# Altium schematic sheet Sheet1.SchDoc
size A; SheetNumber: 1; SheetTotal: 1
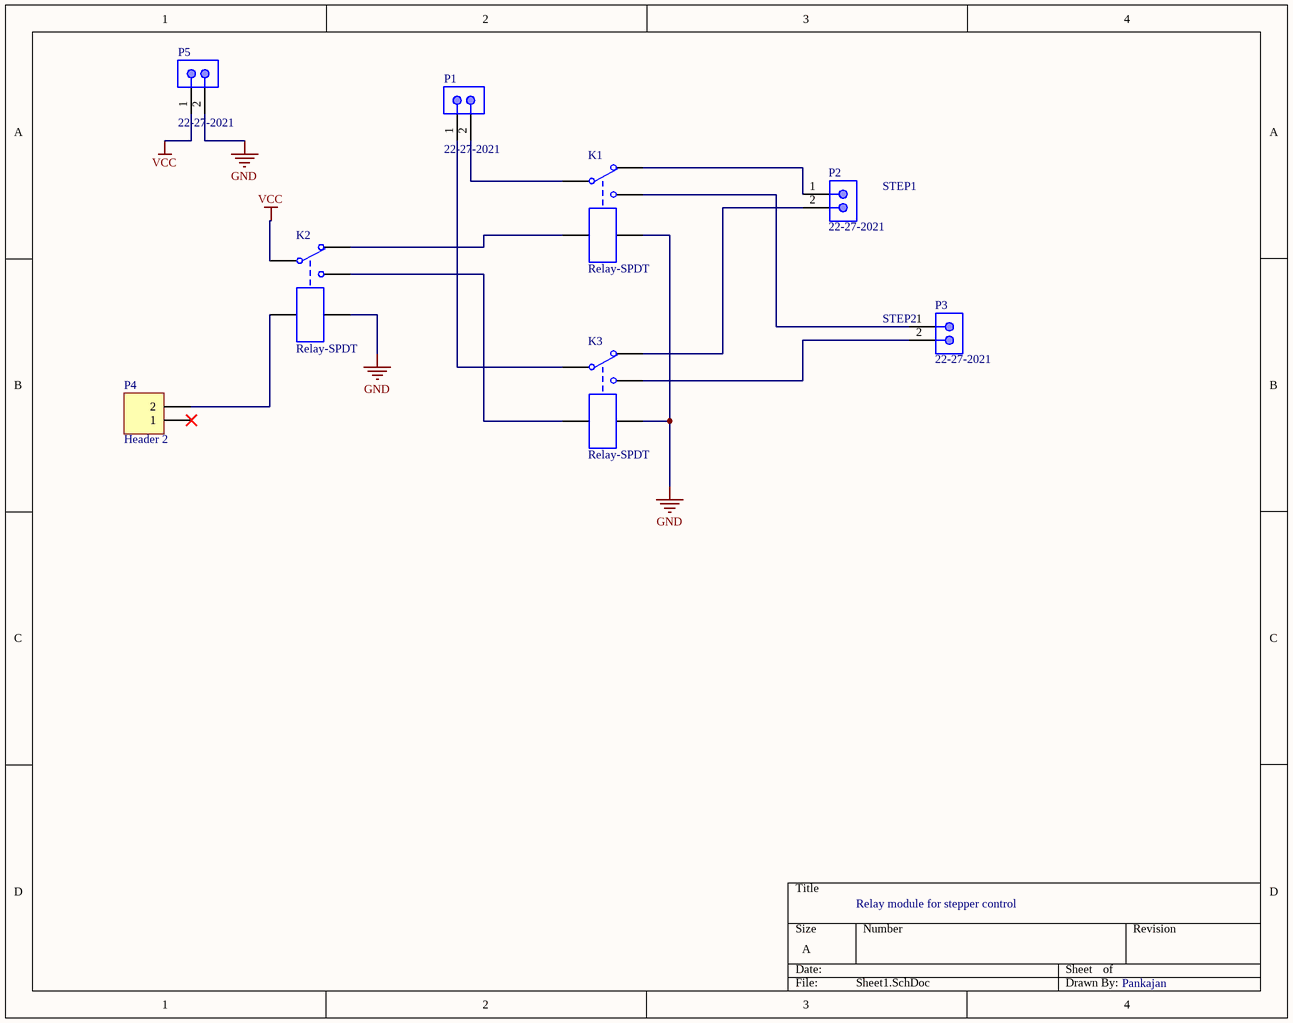
[diagram p0: Sheet1.SchDoc]

## Parts
K1  Relay-SPDT  [MODULE5B]
K2  Relay-SPDT  [MODULE5B]
K3  Relay-SPDT  [MODULE5B]
P1  22-27-2021  [MOLX-22-27-2021_V]
P2  22-27-2021  [MOLX-22-27-2021_V]
P3  22-27-2021  [MOLX-22-27-2021_V]
P4  Header 2  [HDR1X2]
P5  22-27-2021  [MOLX-22-27-2021_V]

## Nets
GND: K1.5 K2.5 K3.5 P5.2
VCC: K2.1 P5.1
NetK1_1: K1.1 P1.2
NetK1_2: K1.2 P2.1
NetK1_3: K1.3 P3.1
NetK1_4: K1.4 K2.2
NetK2_3: K2.3 K3.4
NetK2_4: K2.4 P4.2
NetK3_1: K3.1 P1.1
NetK3_2: K3.2 P2.2
NetK3_3: K3.3 P3.2

Not connected (* = marked no-connect by the designer): P4 1*

## Notes on the sheet
- (near P2) STEP1
- (near P3) STEP2
- Relay module for stepper control
- Pankajan

## Library data of the parts
K1-K3 = Relay-SPDT: Single-Pole Dual-Throw Relay; Published: 24-Mar-1999; LatestRevisionDate: 17-Jul-2002; LatestRevisionNote: Re-released for DXP Platform.; PackageReference: MODULE5B; Publisher: Altium Limited
P1-P3 P5 = CMP-2000-05537-1: Male Header, Pitch 2.54 mm, 1 x 2 Position, Height 11.7 mm, Tail Length 3.56 mm, 0 to 75 degC, RoHS, Bulk; Manufacturer: Molex; PartNumber: 0022272021; Current rating: 4A; Package Version: Rev. BC, 02/2012; Voltage rating: 250V; No. of Positions: 2; Pitch: 2.54mm; No. of Rows: 1; Orientation: Vertical; Operating temperature: 0°Cto+75°C; Manufacturer URL: http://www.molex.com/; Mounting Technology: ThroughHole; Housing material: Nylon(UL94V-0); Package Description: 2-Leads Header, Body 5.08 x 5.8 mm, Pitch 2.54 mm; Voltage - Max: 250V; Datasheet URL: http://www.molex.com/pdm_docs/sd/022272021_sd.pdf; Package Reference: 22-27-2021; Contact material: Tinplatedbrass; Current - Max: 4A; Datasheet Version: Rev. F, 06/2009
P4 = Header 2: Header, 2-Pin; LatestRevisionDate: 17-Jul-2002; LatestRevisionNote: Re-released for DXP Platform.; Publisher: Altium Limited